# Altium schematic sheet RS485.SchDoc
size A4; SheetNumber: 7; SheetTotal: 8
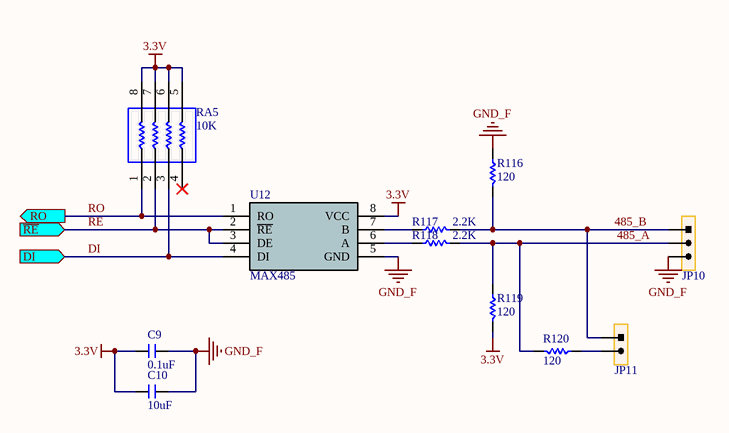
[diagram p0: RS485.SchDoc]

## Parts
C9  0.1uF  [C 0805]
C10  10uF  [C 0805]
JP10  HDR-1X3  [KF2EDGK-3P_H_5.08]  (value not drawn)
JP11  HDR-1X2  [HDR-1X2]  (value not drawn)
R116  120  [R 0805]
R117  2.2K  [R 0805]
R118  2.2K  [R 0805]
R119  120  [R 0805]
R120  120  [R 0805]
RA5  10K  [RA1206 (4x0603)]
U12  MAX485  [SOP8_N]

## Ports
DI (in), RO (out), ~{RE} (in)

## Nets
3.3V: C9.1 C10.1 R119.2 RA5.5 RA5.6 RA5.7 RA5.8 U12.8(VCC)
GND_F: C9.2 C10.2 JP10.3 R116.1 U12.5(GND)
485_A: JP10.2 R118.2 R119.1 R120.2
485_B: JP10.1 JP11.1 R116.2 R117.2
DI: RA5.3 U12.4(DI) ; port DI
~{RE}: RA5.2 U12.2(~{RE}) U12.3(DE) ; port ~{RE}
RO: RA5.1 U12.1(RO) ; port RO
NetJP11_2: JP11.2 R120.1
NetR117_1: R117.1 U12.7(B)
NetR118_1: R118.1 U12.6(A)

Not connected (* = marked no-connect by the designer): RA5 4*

## Library data of the parts
C9 C10 = C: Non-polar patch capacitor; BOM名称: 无极性贴片电容; 版权归属: 源创客; 学习资源: www.ooocke.com
JP10 = Header 3: 3P Connector; BOM名称: 3P接插件; 版权归属: 源创客; 学习资源: www.ooocke.com
JP11 = Header 2: 2P Connector; BOM名称: 2P接插件; 版权归属: 源创客; 学习资源: www.ooocke.com
R116-R120 = R: Chip resistor; 版权归属: 源创客; BOM名称: Chip resistor; 学习资源: www.ooocke.com
RA5 = R-ARR: 4 way Chip Resistor Array
U12 = MAX485: RS485/RS422 Transceivers; BOM名称: MAX232; 版权归属: 源创客; 学习资源: www.ooocke.com